# EAGLE schematic LedController (EAGLE 6.4)
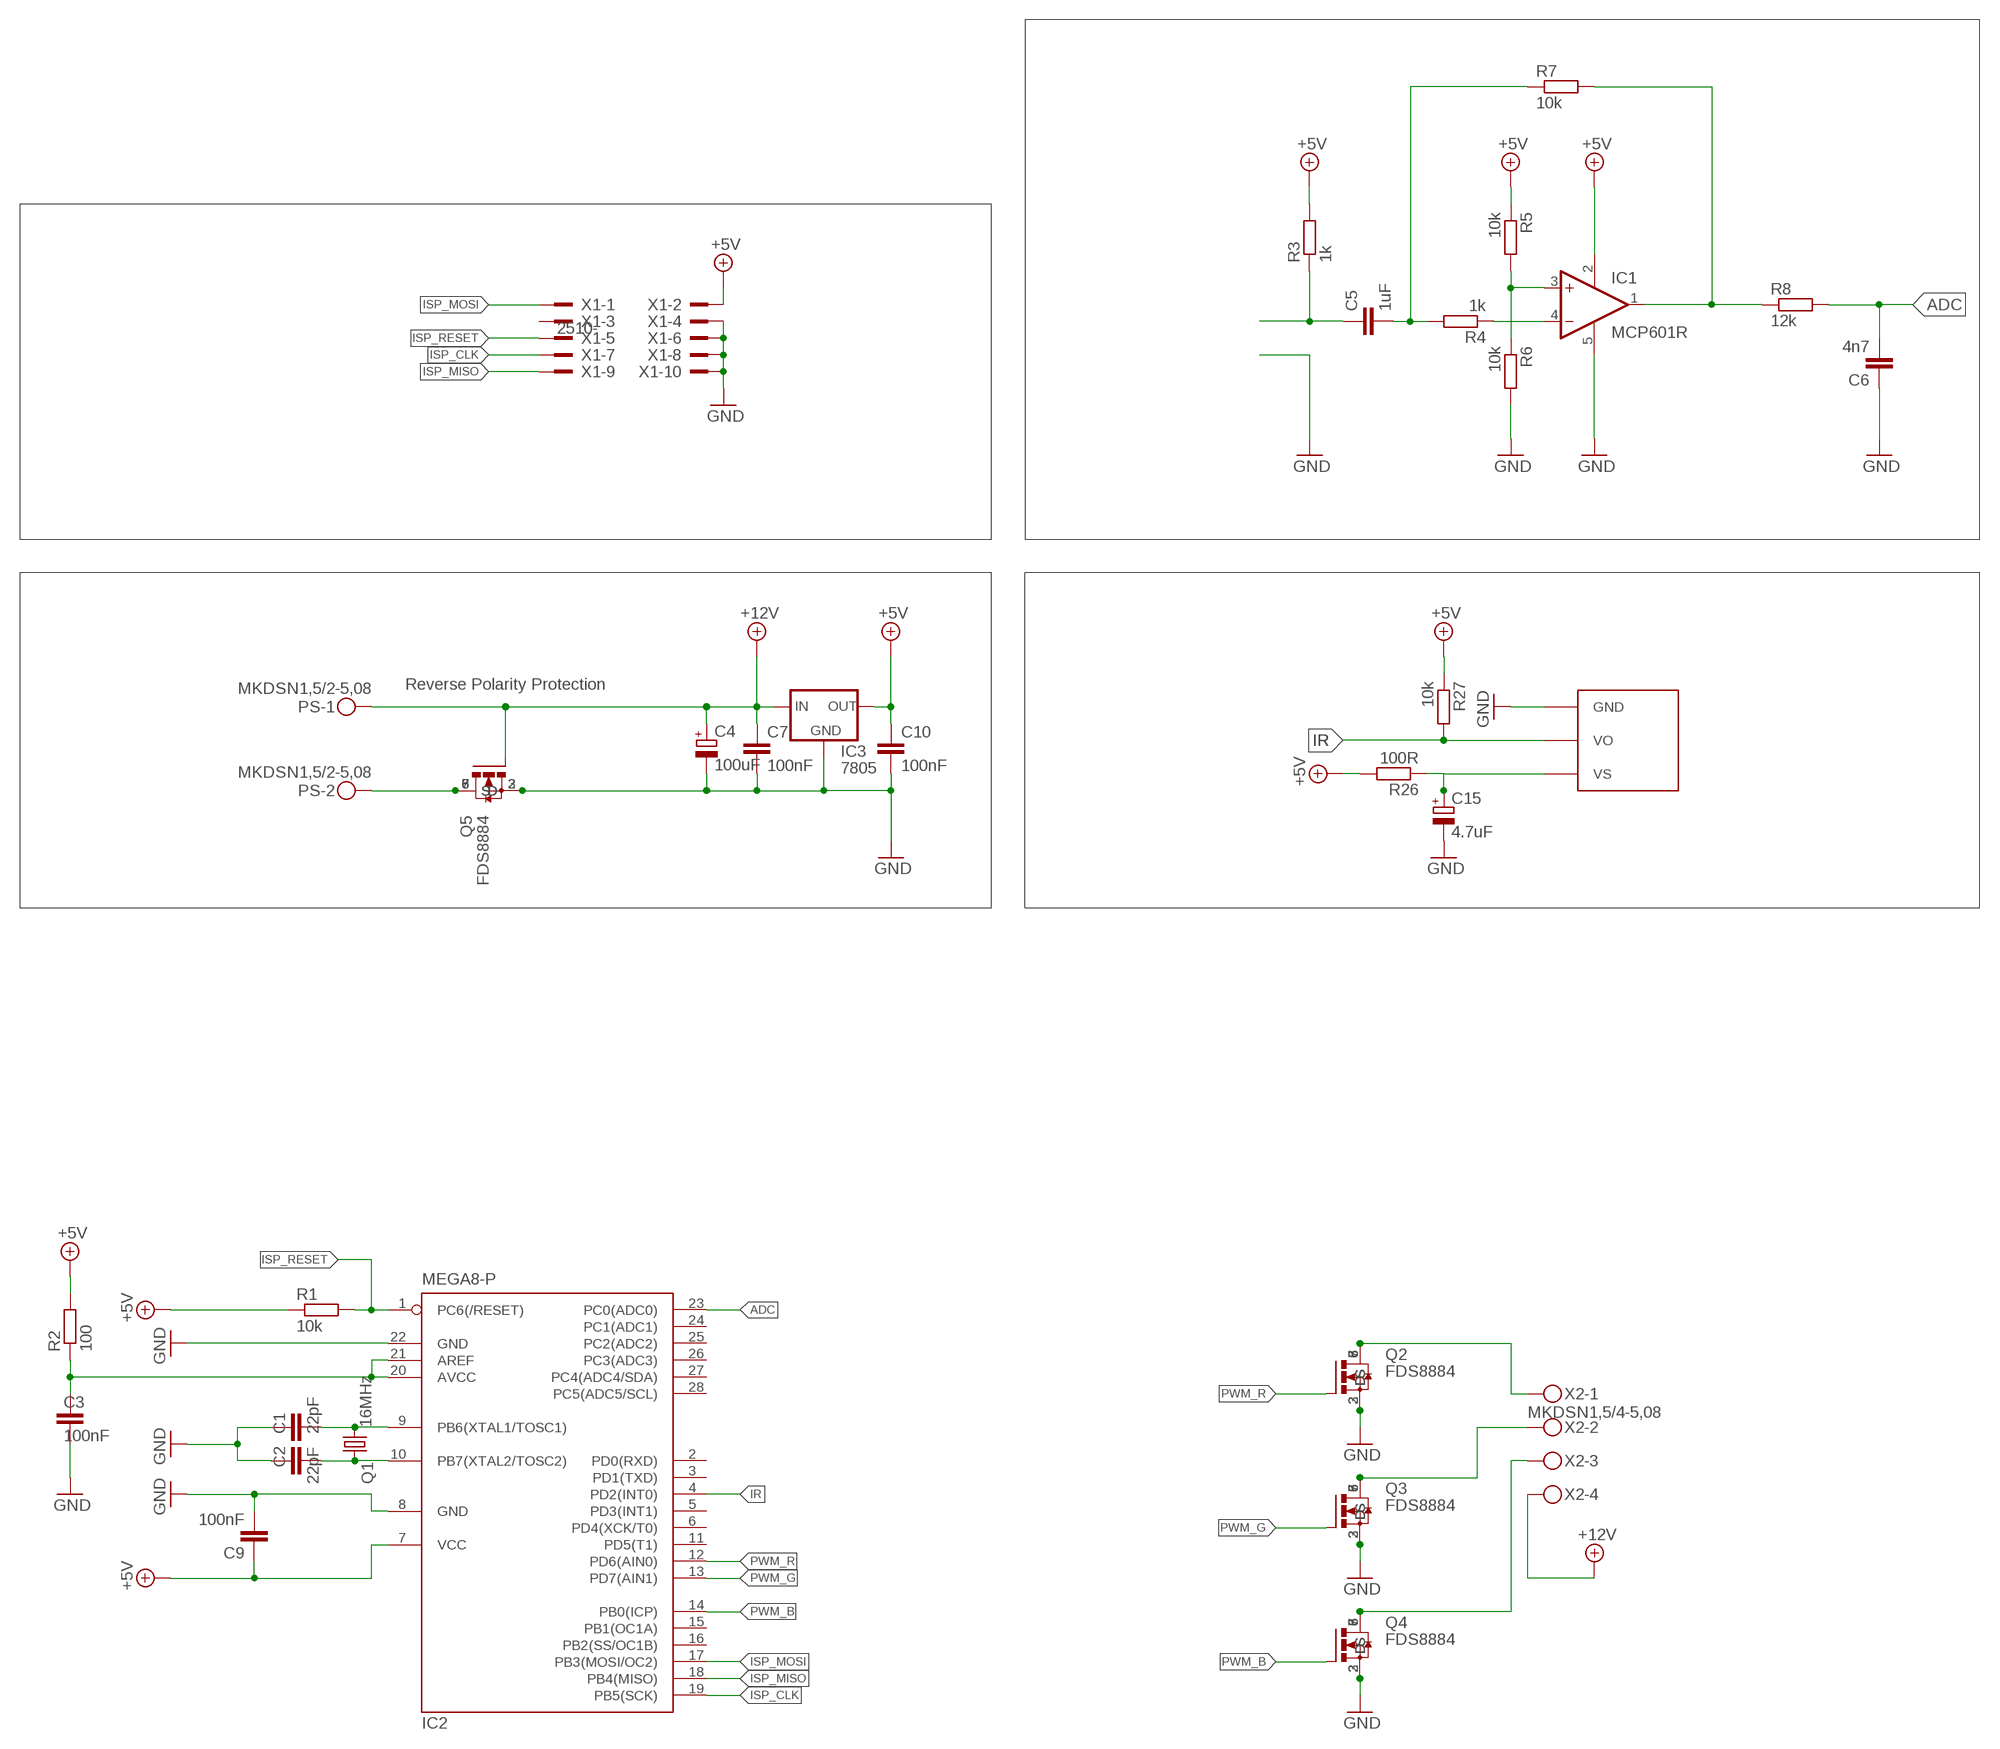
[diagram p0: schematic, sheet 1]

## Parts
C1  22pF  C-EU025-025X050  [C025-025X050]
C2  22pF  C-EU025-025X050  [C025-025X050]
C3  100nF  C-EU025-025X050  [C025-025X050]
C4  100uF  CPOL-EUE2-5  [E2-5]
C5  1uF  C-EU025-024X044  [C025-024X044]
C6  4n7  C-EU025-024X044  [C025-024X044]
C7  100nF  C-EU025-024X044  [C025-024X044]
C9  100nF  C-EU025-024X044  [C025-024X044]
C10  100nF  C-EU025-024X044  [C025-024X044]
C15  4.7uF  CPOL-EUE2-5  [E2-5]
IC1  MCP601R  [SOT23-5]
IC2  MEGA8-P  [DIL28-3]
IC3  7805  78XXS  [78XXS]
PS  MKDSN1,5/2-5,08  [MKDSN1,5/2-5,08]
Q1  16MHz  CRYSTALHC49S  [HC49/S]
Q2  FDS8884  [SO08]
Q3  FDS8884  [SO08]
Q4  FDS8884  [SO08]
Q5  FDS8884  [SO08]
R1  10k  R-EU_0207/2V  [0207/2V]
R2  100  R-EU_0207/2V  [0207/2V]
R3  1k  R-EU_0207/2V  [0207/2V]
R4  1k  R-EU_0207/2V  [0207/2V]
R5  10k  R-EU_0207/2V  [0207/2V]
R6  10k  R-EU_0207/2V  [0207/2V]
R7  10k  R-EU_0207/2V  [0207/2V]
R8  12k  R-EU_0207/2V  [0207/2V]
R26  100R  R-EU_0207/10  [0207/10]
R27  10k  R-EU_0207/10  [0207/10]
TSOP  TSOP  [TSOP]
X1  2510-  [PAK100/2500-10]
X2  MKDSN1,5/4-5,08  [MKDSN1,5/4-5,08]

## Nets
+5V: C9.1 C10.1 IC1.2(V+) IC2.7(VCC) IC3.OUT R1.1 R2.2 R3.2 R5.1 R26.2 R27.1 X1.2
+12V: C4.+ C7.1 IC3.IN PS.1 Q5.4(G) X2.4
ADC: C6.2 IC2.23(PC0(ADC0)) R8.2
GND: C1.1 C2.1 C3.2 C4.- C6.1 C7.2 C9.2 C10.2 C15.- IC1.5(V-) IC2.8(GND) IC2.22(GND) IC3.GND Q2.1(S) Q2.2(S) Q2.3(S) Q3.1(S) Q3.2(S) Q3.3(S) Q4.1(S) Q4.2(S) Q4.3(S) Q5.1(S) Q5.2(S) Q5.3(S) R6.2 TSOP.GND X1.4 X1.6 X1.8 X1.10
IR: IC2.4(PD2(INT0)) R27.2 TSOP.VO
ISP_CLK: IC2.19(PB5(SCK)) X1.7
ISP_MISO: IC2.18(PB4(MISO)) X1.9
ISP_MOSI: IC2.17(PB3(MOSI/OC2)) X1.1
ISP_RESET: IC2.1(PC6(/RESET)) R1.2 X1.5
N$1: C5.1 R3.1
N$2: C1.2 IC2.9(PB6(XTAL1/TOSC1)) Q1.2
N$3: C2.2 IC2.10(PB7(XTAL2/TOSC2)) Q1.1
N$4: Q2.5(D) Q2.6(D) Q2.7(D) Q2.8(D) X2.1
N$5: Q3.5(D) Q3.6(D) Q3.7(D) Q3.8(D) X2.2
N$6: Q4.5(D) Q4.6(D) Q4.7(D) Q4.8(D) X2.3
N$7: C3.1 IC2.20(AVCC) IC2.21(AREF) R2.1
N$8: PS.2 Q5.5(D) Q5.6(D) Q5.7(D) Q5.8(D)
N$9: C5.2 R4.2 R7.1
N$10: IC1.4(-IN) R4.1
N$11: IC1.3(+IN) R5.2 R6.1
N$12: IC1.1(OUT) R7.2 R8.1
N$63: C15.+ R26.1 TSOP.VS
PWM_B: IC2.14(PB0(ICP)) Q4.4(G)
PWM_G: IC2.13(PD7(AIN1)) Q3.4(G)
PWM_R: IC2.12(PD6(AIN0)) Q2.4(G)
Unconnected: IC2.2(PD0(RXD)) IC2.3(PD1(TXD)) IC2.5(PD3(INT1)) IC2.6(PD4(XCK/T0)) IC2.11(PD5(T1)) IC2.15(PB1(OC1A)) IC2.16(PB2(SS/OC1B)) IC2.24(PC1(ADC1)) IC2.25(PC2(ADC2)) IC2.26(PC3(ADC3)) IC2.27(PC4(ADC4/SDA)) IC2.28(PC5(ADC5/SCL)) X1.3

## Notes on the sheet
- Reverse Polarity Protection

## Library data of the parts
C1-C3 C5-C7 C9 C10 = rcl:C-EU: CAPACITOR, European symbol
C4 C15 = rcl:CPOL-EU: POLARIZED CAPACITOR, European symbol
IC1 = linear:MCP601: Single Op Amp 2.7V to 6.0V Single Supply CMOS Source: http://ww1.microchip.com/downloads/en/DeviceDoc/21314g.pdf
IC2 = atmel:MEGA8-P: MICROCONTROLLER 8 Kbytes FLASH, 1 kbytes SRAM, 512 bytes EEPROM, USART, 4-channel 10 bit ADC, 2-channel 8 bit ADC Pin compatible with Atmega48, ATMega88, ATMega168 Source: avr.lbr
IC3 = v-reg:78XXS: VOLTAGE REGULATOR
PS = con-phoenix-508:MKDSN1,5/2-5,08: MKDSN 1,5/ 2-5,08 Printklemme Nennstrom: 13,5 A Nennspannung: 250 V Rastermaß: 5,08 mm Polzahl: 2 Anschlussart: Schraubanschluss Montage: Löten Anschlussrichtung Leiter/Platine: 0 ° Artikelnummer: 1729128 Source: http://eshop.phoenixcontact.com .. 1729128.pdf
Q1 = crystal:CRYSTAL: CRYSTAL
Q2-Q5 = FDS8884:FDS8884: OptiMOS(R)-P Small-Signal-Transistor P-Channel, Enhancement mode, Logic Level ID -5.5 A Source: http://www.infineon.com/upload/Document/BSL307SP_Rev%201.2.pdf
R1-R8 R26 R27 = rcl:R-EU_: RESISTOR, European symbol
TSOP = TSOP1736:TSOP
X1 = con-3m:2510-: 3M (TM) Pak 100 4-Wall Header Source: 3M
X2 = con-phoenix-508:MKDSN1,5/4-5,08: MKDSN 1,5/ 4-5,08 Printklemme Nennstrom: 13,5 A Nennspannung: 250 V Rastermaß: 5,08 mm Polzahl: 4 Anschlussart: Schraubanschluss Montage: Löten Anschlussrichtung Leiter/Platine: 0 ° Artikelnummer: 1729144 Source: http://eshop.phoenixcontact.com .. 1729144.pdf

## Net classes
0 default: width 0.4 mm
1 +12V: width 0.406 mm